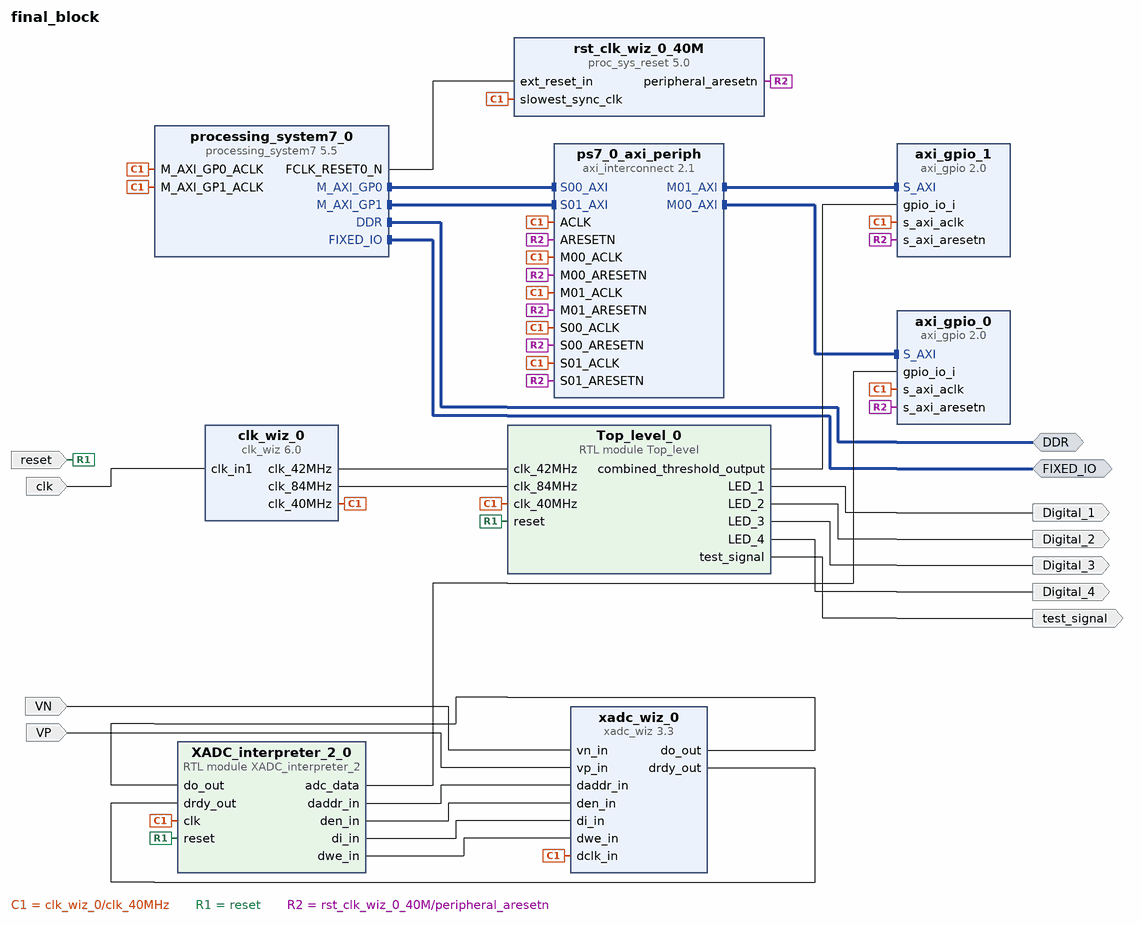
[diagram p0: block diagram of the top level]
# Vivado block design final_block, xc7z007sclg400-1, Vivado 2024.1
create_bd_design final_block

create_bd_intf_port -mode Master -vlnv xilinx.com:interface:ddrx_rtl:1.0 DDR
create_bd_intf_port -mode Master -vlnv xilinx.com:display_processing_system7:fixedio_rtl:1.0 FIXED_IO
create_bd_port -dir I VP
create_bd_port -dir I VN
create_bd_port -dir O Digital_1
create_bd_port -dir O Digital_2
create_bd_port -dir O Digital_3
create_bd_port -dir O Digital_4
create_bd_port -dir I -type rst reset
create_bd_port -dir O test_signal
create_bd_port -dir I clk

create_bd_cell -type ip -vlnv xilinx.com:ip:processing_system7:5.5 processing_system7_0
set_property -dict [list \
  CONFIG.PCW_APU_PERIPHERAL_FREQMHZ 650 \
  CONFIG.PCW_CRYSTAL_PERIPHERAL_FREQMHZ 50 \
  CONFIG.PCW_ENET0_ENET0_IO {MIO 16 .. 27} \
  CONFIG.PCW_ENET0_GRP_MDIO_ENABLE 1 \
  CONFIG.PCW_ENET0_GRP_MDIO_IO {MIO 52 .. 53} \
  CONFIG.PCW_ENET0_PERIPHERAL_ENABLE 1 \
  CONFIG.PCW_ENET0_RESET_ENABLE 1 \
  CONFIG.PCW_ENET0_RESET_IO {MIO 9} \
  CONFIG.PCW_ENET_RESET_ENABLE 1 \
  CONFIG.PCW_ENET_RESET_SELECT {Share reset pin} \
  CONFIG.PCW_EN_CLK0_PORT 0 \
  CONFIG.PCW_FPGA0_PERIPHERAL_FREQMHZ 42 \
  CONFIG.PCW_FPGA1_PERIPHERAL_FREQMHZ 84 \
  CONFIG.PCW_FPGA2_PERIPHERAL_FREQMHZ 40 \
  CONFIG.PCW_GPIO_MIO_GPIO_ENABLE 1 \
  CONFIG.PCW_GPIO_MIO_GPIO_IO MIO \
  CONFIG.PCW_I2C_RESET_ENABLE 0 \
  CONFIG.PCW_PRESET_BANK1_VOLTAGE {LVCMOS 1.8V} \
  CONFIG.PCW_QSPI_PERIPHERAL_ENABLE 0 \
  CONFIG.PCW_SD0_GRP_CD_ENABLE 1 \
  CONFIG.PCW_SD0_GRP_CD_IO {MIO 47} \
  CONFIG.PCW_SD0_GRP_WP_ENABLE 0 \
  CONFIG.PCW_SD0_PERIPHERAL_ENABLE 1 \
  CONFIG.PCW_SD0_SD0_IO {MIO 40 .. 45} \
  CONFIG.PCW_SDIO_PERIPHERAL_FREQMHZ 100 \
  CONFIG.PCW_UART0_PERIPHERAL_ENABLE 1 \
  CONFIG.PCW_UART0_UART0_IO {MIO 14 .. 15} \
  CONFIG.PCW_UART_PERIPHERAL_FREQMHZ 100 \
  CONFIG.PCW_UIPARAM_DDR_BUS_WIDTH {16 Bit} \
  CONFIG.PCW_UIPARAM_DDR_FREQ_MHZ 525 \
  CONFIG.PCW_UIPARAM_DDR_PARTNO {MT41K256M16 RE-125} \
  CONFIG.PCW_USB0_PERIPHERAL_ENABLE 1 \
  CONFIG.PCW_USB0_RESET_ENABLE 1 \
  CONFIG.PCW_USB0_RESET_IO {MIO 46} \
  CONFIG.PCW_USB0_USB0_IO {MIO 28 .. 39} \
  CONFIG.PCW_USB_RESET_ENABLE 1 \
  CONFIG.PCW_USB_RESET_SELECT {Share reset pin} \
  CONFIG.PCW_USE_M_AXI_GP1 1 \
] [get_bd_cells processing_system7_0]
# 293 more settings of processing_system7_0 are not shown: defaults, MIO pin electricals, DDR timing, and values the tool derives
create_bd_cell -type ip -vlnv xilinx.com:ip:xadc_wiz:3.3 xadc_wiz_0
set_property -dict [list \
  CONFIG.ADC_CONVERSION_RATE 770 \
  CONFIG.DCLK_FREQUENCY 40 \
  CONFIG.ENABLE_RESET false \
  CONFIG.ENABLE_VCCDDRO_ALARM false \
  CONFIG.ENABLE_VCCPAUX_ALARM false \
  CONFIG.ENABLE_VCCPINT_ALARM false \
  CONFIG.INTERFACE_SELECTION ENABLE_DRP \
  CONFIG.OT_ALARM false \
  CONFIG.SINGLE_CHANNEL_SELECTION VP_VN \
  CONFIG.USER_TEMP_ALARM false \
  CONFIG.VCCAUX_ALARM false \
  CONFIG.VCCINT_ALARM false \
] [get_bd_cells xadc_wiz_0]
create_bd_cell -type ip -vlnv xilinx.com:ip:clk_wiz:6.0 clk_wiz_0
set_property -dict [list \
  CONFIG.CLKIN1_JITTER_PS 80.0 \
  CONFIG.CLKOUT1_JITTER 171.507 \
  CONFIG.CLKOUT1_PHASE_ERROR 116.462 \
  CONFIG.CLKOUT1_REQUESTED_OUT_FREQ 42 \
  CONFIG.CLKOUT2_JITTER 147.938 \
  CONFIG.CLKOUT2_PHASE_ERROR 116.462 \
  CONFIG.CLKOUT2_REQUESTED_OUT_FREQ 84 \
  CONFIG.CLKOUT2_USED true \
  CONFIG.CLKOUT3_JITTER 173.092 \
  CONFIG.CLKOUT3_PHASE_ERROR 116.462 \
  CONFIG.CLKOUT3_REQUESTED_OUT_FREQ 40 \
  CONFIG.CLKOUT3_USED true \
  CONFIG.CLK_OUT1_PORT clk_42MHz \
  CONFIG.CLK_OUT2_PORT clk_84MHz \
  CONFIG.CLK_OUT3_PORT clk_40MHz \
  CONFIG.MMCM_CLKFBOUT_MULT_F 16.125 \
  CONFIG.MMCM_CLKIN1_PERIOD 8.000 \
  CONFIG.MMCM_CLKIN2_PERIOD 10.000 \
  CONFIG.MMCM_CLKOUT0_DIVIDE_F 24.000 \
  CONFIG.MMCM_CLKOUT1_DIVIDE 12 \
  CONFIG.MMCM_CLKOUT2_DIVIDE 25 \
  CONFIG.MMCM_DIVCLK_DIVIDE 2 \
  CONFIG.NUM_OUT_CLKS 3 \
  CONFIG.PRIM_IN_FREQ 125 \
  CONFIG.USE_LOCKED false \
  CONFIG.USE_RESET false \
] [get_bd_cells clk_wiz_0]
create_bd_cell -type module -reference XADC_interpreter_2 XADC_interpreter_2_0
create_bd_cell -type module -reference Top_level Top_level_0
create_bd_cell -type ip -vlnv xilinx.com:ip:axi_gpio:2.0 axi_gpio_0
set_property -dict {CONFIG.C_ALL_INPUTS 1 CONFIG.C_GPIO_WIDTH 16} [get_bd_cells axi_gpio_0]
create_bd_cell -type ip -vlnv xilinx.com:ip:axi_interconnect:2.1 ps7_0_axi_periph
set_property -dict {CONFIG.NUM_MI 2 CONFIG.NUM_SI 2} [get_bd_cells ps7_0_axi_periph]
create_bd_cell -type ip -vlnv xilinx.com:ip:proc_sys_reset:5.0 rst_clk_wiz_0_40M
create_bd_cell -type ip -vlnv xilinx.com:ip:axi_gpio:2.0 axi_gpio_1
set_property -dict {CONFIG.C_ALL_INPUTS 1} [get_bd_cells axi_gpio_1]

# ---- connections ----

connect_bd_intf_net [get_bd_intf_ports DDR] [get_bd_intf_pins processing_system7_0/DDR]
connect_bd_intf_net [get_bd_intf_ports FIXED_IO] [get_bd_intf_pins processing_system7_0/FIXED_IO]
connect_bd_intf_net [get_bd_intf_pins processing_system7_0/M_AXI_GP0] [get_bd_intf_pins ps7_0_axi_periph/S00_AXI]
connect_bd_intf_net [get_bd_intf_pins processing_system7_0/M_AXI_GP1] [get_bd_intf_pins ps7_0_axi_periph/S01_AXI]
connect_bd_intf_net [get_bd_intf_pins ps7_0_axi_periph/M00_AXI] [get_bd_intf_pins axi_gpio_0/S_AXI]
connect_bd_intf_net [get_bd_intf_pins ps7_0_axi_periph/M01_AXI] [get_bd_intf_pins axi_gpio_1/S_AXI]
connect_bd_net [get_bd_pins Top_level_0/LED_1] [get_bd_ports Digital_1]
connect_bd_net [get_bd_pins Top_level_0/LED_2] [get_bd_ports Digital_2]
connect_bd_net [get_bd_pins Top_level_0/LED_3] [get_bd_ports Digital_3]
connect_bd_net [get_bd_pins Top_level_0/LED_4] [get_bd_ports Digital_4]
connect_bd_net [get_bd_pins Top_level_0/combined_threshold_output] [get_bd_pins axi_gpio_1/gpio_io_i]
connect_bd_net [get_bd_pins Top_level_0/test_signal] [get_bd_ports test_signal]
connect_bd_net [get_bd_ports VN] [get_bd_pins xadc_wiz_0/vn_in]
connect_bd_net [get_bd_ports VP] [get_bd_pins xadc_wiz_0/vp_in]
connect_bd_net [get_bd_pins XADC_interpreter_2_0/adc_data] [get_bd_pins axi_gpio_0/gpio_io_i]
connect_bd_net [get_bd_pins XADC_interpreter_2_0/daddr_in] [get_bd_pins xadc_wiz_0/daddr_in]
connect_bd_net [get_bd_pins XADC_interpreter_2_0/den_in] [get_bd_pins xadc_wiz_0/den_in]
connect_bd_net [get_bd_pins XADC_interpreter_2_0/di_in] [get_bd_pins xadc_wiz_0/di_in]
connect_bd_net [get_bd_pins XADC_interpreter_2_0/dwe_in] [get_bd_pins xadc_wiz_0/dwe_in]
connect_bd_net [get_bd_ports clk] [get_bd_pins clk_wiz_0/clk_in1]
connect_bd_net [get_bd_pins clk_wiz_0/clk_40MHz] \
  [get_bd_pins processing_system7_0/M_AXI_GP0_ACLK] [get_bd_pins processing_system7_0/M_AXI_GP1_ACLK] \
  [get_bd_pins xadc_wiz_0/dclk_in] [get_bd_pins XADC_interpreter_2_0/clk] [get_bd_pins Top_level_0/clk_40MHz] \
  [get_bd_pins ps7_0_axi_periph/ACLK] [get_bd_pins ps7_0_axi_periph/S00_ACLK] \
  [get_bd_pins rst_clk_wiz_0_40M/slowest_sync_clk] [get_bd_pins axi_gpio_0/s_axi_aclk] \
  [get_bd_pins ps7_0_axi_periph/M00_ACLK] [get_bd_pins ps7_0_axi_periph/S01_ACLK] [get_bd_pins axi_gpio_1/s_axi_aclk] \
  [get_bd_pins ps7_0_axi_periph/M01_ACLK]
connect_bd_net [get_bd_pins clk_wiz_0/clk_42MHz] [get_bd_pins Top_level_0/clk_42MHz]
connect_bd_net [get_bd_pins clk_wiz_0/clk_84MHz] [get_bd_pins Top_level_0/clk_84MHz]
connect_bd_net [get_bd_pins processing_system7_0/FCLK_RESET0_N] [get_bd_pins rst_clk_wiz_0_40M/ext_reset_in]
connect_bd_net [get_bd_ports reset] [get_bd_pins XADC_interpreter_2_0/reset] [get_bd_pins Top_level_0/reset]
connect_bd_net [get_bd_pins rst_clk_wiz_0_40M/peripheral_aresetn] \
  [get_bd_pins ps7_0_axi_periph/S00_ARESETN] [get_bd_pins axi_gpio_0/s_axi_aresetn] \
  [get_bd_pins ps7_0_axi_periph/M00_ARESETN] [get_bd_pins ps7_0_axi_periph/ARESETN] \
  [get_bd_pins ps7_0_axi_periph/S01_ARESETN] [get_bd_pins axi_gpio_1/s_axi_aresetn] \
  [get_bd_pins ps7_0_axi_periph/M01_ARESETN]
connect_bd_net [get_bd_pins xadc_wiz_0/do_out] [get_bd_pins XADC_interpreter_2_0/do_out]
connect_bd_net [get_bd_pins xadc_wiz_0/drdy_out] [get_bd_pins XADC_interpreter_2_0/drdy_out]

# ---- address map ----
assign_bd_address -offset 0x41200000 -range 64K -target_address_space [get_bd_addr_spaces processing_system7_0/Data] [get_bd_addr_segs axi_gpio_0/S_AXI/Reg]
assign_bd_address -offset 0x7FFF8000 -range 32K -target_address_space [get_bd_addr_spaces processing_system7_0/Data] [get_bd_addr_segs axi_gpio_1/S_AXI/Reg]
assign_bd_address -offset 0x80000000 -range 32K -target_address_space [get_bd_addr_spaces processing_system7_0/Data] [get_bd_addr_segs axi_gpio_1/S_AXI/Reg]

validate_bd_design
save_bd_design
